# Altium project ESP32_HID_GLCD.PrjPcb
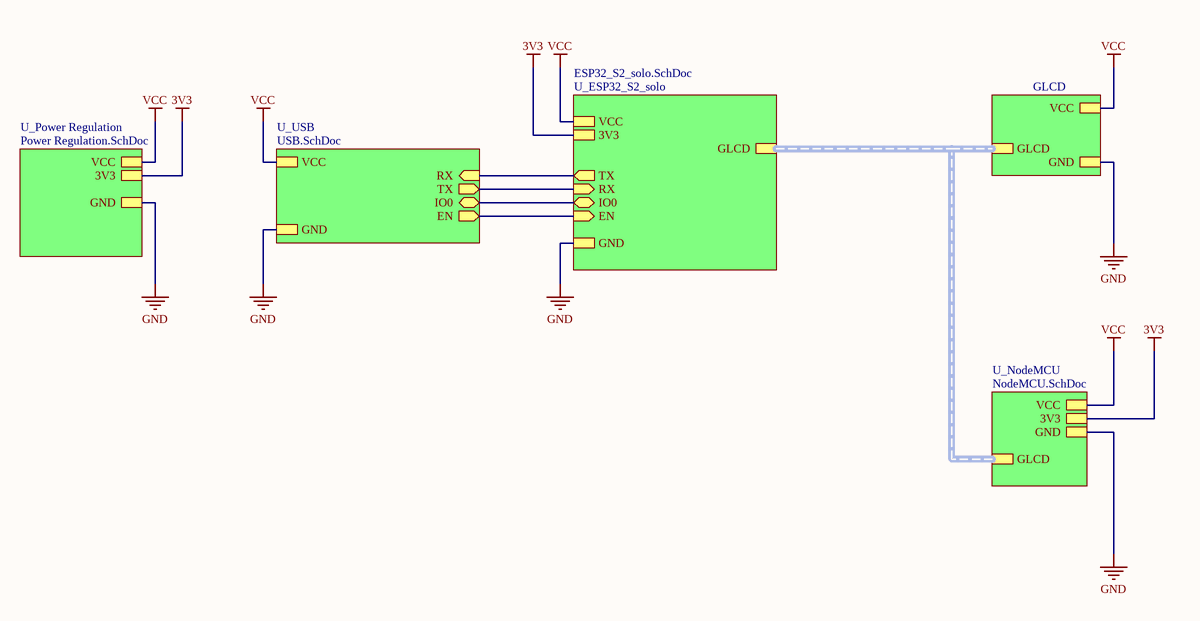
[diagram p0: Block Diagram.SchDoc]
6 sheets, 48 parts. Net scope: strictly hierarchical (ports join the sheet entries above them; power ports are local).
Board file: ESP32_HID.PcbDoc
Sheets:
  Block Diagram.SchDoc
    GLCD = GLCD.SchDoc
    U_ESP32_S2_solo = ESP32_S2_solo.SchDoc
    U_NodeMCU = NodeMCU.SchDoc
    U_Power Regulation = Power Regulation.SchDoc
    U_USB = USB.SchDoc

## Sheet Block Diagram.SchDoc: Block diagram
size A4; Engineer: Naif Aljophani; DocumentNumber: 1; Revision: V1.0; SheetNumber: 1; SheetTotal: 6

### Sub-sheets
GLCD = GLCD.SchDoc: VCC, GND, GLCD (harness GLCD)
U_ESP32_S2_solo = ESP32_S2_solo.SchDoc: 3V3, GND, VCC, IO0 (bidir), EN (in), TX (out), RX (in), GLCD (harness GLCD)
U_NodeMCU = NodeMCU.SchDoc: VCC, 3V3, GND, GLCD (harness GLCD)
U_Power Regulation = Power Regulation.SchDoc: 3V3, GND, VCC
U_USB = USB.SchDoc: GND, EN (out), IO0 (bidir), VCC, RX (in), TX (out)

### Nets
3V3: sheet U_ESP32_S2_solo/3V3, sheet U_NodeMCU/3V3, sheet U_Power Regulation/3V3
GND: sheet GLCD/GND, sheet U_ESP32_S2_solo/GND, sheet U_NodeMCU/GND, sheet U_Power Regulation/GND, sheet U_USB/GND
VCC: sheet GLCD/VCC, sheet U_ESP32_S2_solo/VCC, sheet U_NodeMCU/VCC, sheet U_Power Regulation/VCC, sheet U_USB/VCC
EN: sheet U_ESP32_S2_solo/EN, sheet U_USB/EN
IO0: sheet U_ESP32_S2_solo/IO0, sheet U_USB/IO0
UART1: sheet U_ESP32_S2_solo/RX, sheet U_USB/TX
UART2: sheet U_ESP32_S2_solo/TX, sheet U_USB/RX

### Buses and harness runs
harness sheet GLCD/GLCD = sheet U_ESP32_S2_solo/GLCD = sheet U_NodeMCU/GLCD

## Sheet GLCD.SchDoc: GLCD ILI9488
size A4; Engineer: Naif Aljohani; DocumentNumber: 2; Revision: V1.0; SheetNumber: 2; SheetTotal: 8
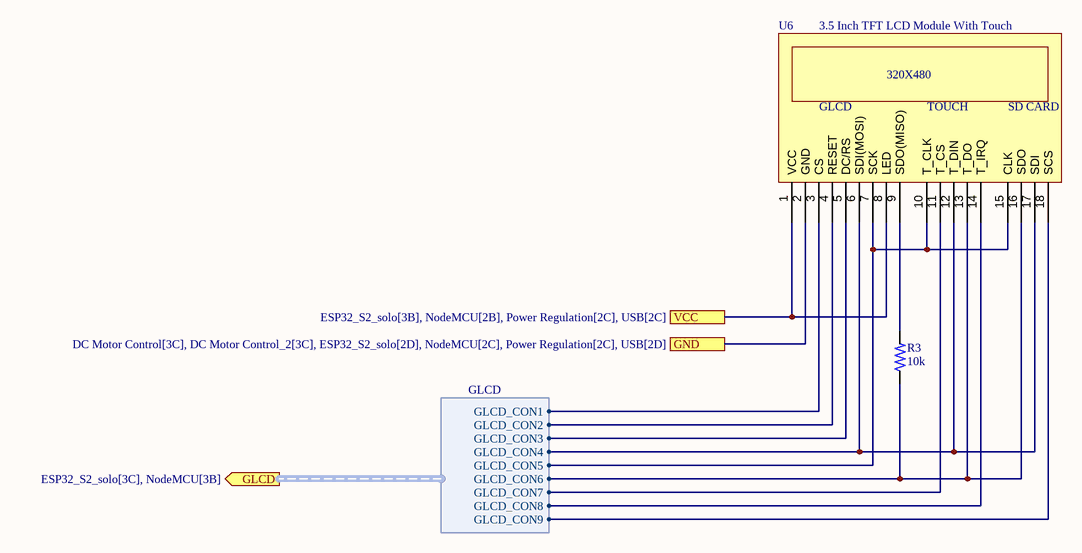
[diagram p1: GLCD.SchDoc]

### Parts
R3  10k  [RESC3115X65N]
U6  3.5 Inch TFT LCD Module With Touch  [PCBComponent_1]

### Ports
GLCD (out, harness GLCD, see ESP32_S2_solo[3C], NodeMCU[3B]), GND (see DC Motor Control[3C], DC Motor Control_2[3C], ESP32_S2_solo[2D], NodeMCU[2C], Power Regulation[2C], USB[2D]), VCC (see ESP32_S2_solo[3B], NodeMCU[2B], Power Regulation[2C], USB[2C])

### Harnesses
GLCD: GLCD_CON1, GLCD_CON2, GLCD_CON3, GLCD_CON4, GLCD_CON5, GLCD_CON6, GLCD_CON7, GLCD_CON8, GLCD_CON9

### Nets
GND: U6.2(GND) ; port GND
VCC: U6.1(VCC) U6.8(LED) ; port VCC
GLCD_CON1: U6.3(CS) ; port GLCD.GLCD_CON1
GLCD_CON2: U6.4(RESET) ; port GLCD.GLCD_CON2
GLCD_CON3: U6.5(DC/RS) ; port GLCD.GLCD_CON3
GLCD_CON4: U6.6(SDI(MOSI)) U6.12(T_DIN) U6.17(SDI) ; port GLCD.GLCD_CON4
GLCD_CON5: U6.7(SCK) U6.10(T_CLK) U6.15(CLK) ; port GLCD.GLCD_CON5
GLCD_CON6: R3.1 U6.13(T_DO) U6.16(SDO) ; port GLCD.GLCD_CON6
GLCD_CON7: U6.11(T_CS) ; port GLCD.GLCD_CON7
GLCD_CON8: U6.14(T_IRQ) ; port GLCD.GLCD_CON8
GLCD_CON9: U6.18(SCS) ; port GLCD.GLCD_CON9
NetR3_2: R3.2 U6.9(SDO(MISO))

### Notes on the sheet
- (in symbol ILI9488) 320X480; GLCD; TOUCH; SD CARD

### Library data of the parts
R3 = 1-1879462-4: RL73H 2B R43 1% 10 RL; MF: {'manufacturer': u'TE Connectivity'}; Package: None; Price: None; Value: *; MP: 1-1879462-4; Availability: Unavailable
U6 = ILI9488: ComponentLink1Description: New link; ComponentLink1URL: https://www.aliexpress.com/item/32954128438.html?spm=a2g0o.order_list.order_list_main.44.5fd61802HfjXd0

## Sheet ESP32_S2_solo.SchDoc
size A4; Engineer: Naif Aljohani; DocumentNumber: 3; Revision: v1.0; SheetNumber: 3; SheetTotal: 6; SPICEModelCacheSFRKXKUM: <root> / <DocumentId>SFRKXKUM</DocumentId> / </root>
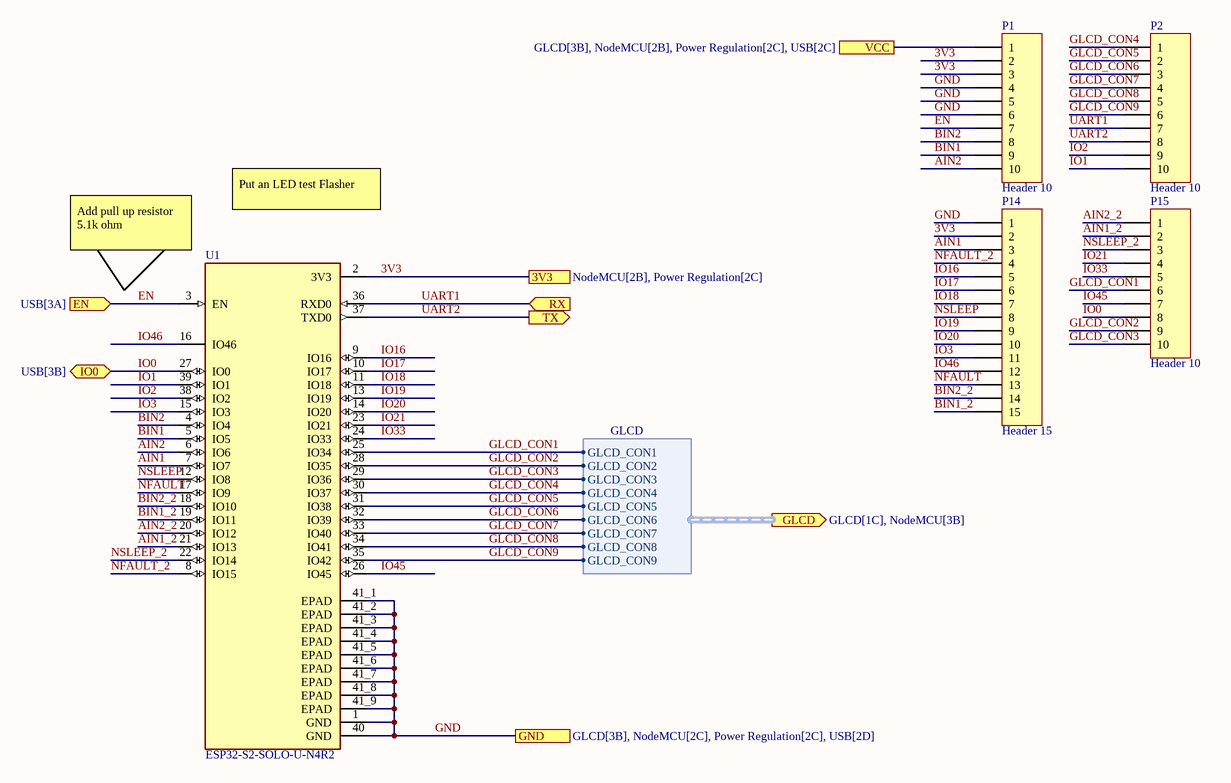
[diagram p2: ESP32_S2_solo.SchDoc]

### Parts
P1  Header 10  [HDR1X10]
P2  Header 10  [HDR1X10]
P14  Header 15  [HDR1X15]
P15  Header 10  [HDR1X10]
U1  ESP32-S2-SOLO-U-N4R2  [XCVR_ESP32-S2-SOLO-U-N4R2]

### Ports
3V3 (see NodeMCU[2B], Power Regulation[2C]), EN (in, see USB[3A]), GLCD (out, harness GLCD, see GLCD[1C], NodeMCU[3B]), GND (see GLCD[3B], NodeMCU[2C], Power Regulation[2C], USB[2D]), IO0 (bidir, see USB[3B]), RX (in), TX (out), VCC (see GLCD[3B], NodeMCU[2B], Power Regulation[2C], USB[2C])

### Harnesses
GLCD: GLCD_CON1, GLCD_CON2, GLCD_CON3, GLCD_CON4, GLCD_CON5, GLCD_CON6, GLCD_CON7, GLCD_CON8, GLCD_CON9

### Nets
3V3: P1.2 P1.3 P14.2 U1.2(3V3) ; port 3V3
GND: P1.4 P1.5 P1.6 P14.1 U1.1(GND) U1.40(GND) U1.41_1(EPAD) U1.41_2(EPAD) U1.41_3(EPAD) U1.41_4(EPAD) U1.41_5(EPAD) U1.41_6(EPAD) U1.41_7(EPAD) U1.41_8(EPAD) U1.41_9(EPAD) ; port GND
VCC: P1.1 ; port VCC
AIN1: P14.3 U1.7(IO7)
AIN1_2: P15.2 U1.21(IO13)
AIN2: P1.10 U1.6(IO6)
AIN2_2: P15.1 U1.20(IO12)
BIN1: P1.9 U1.5(IO5)
BIN1_2: P14.15 U1.19(IO11)
BIN2: P1.8 U1.4(IO4)
BIN2_2: P14.14 U1.18(IO10)
EN: P1.7 U1.3(EN) ; port EN
GLCD_CON1: P15.6 U1.25(IO34) ; port GLCD.GLCD_CON1
GLCD_CON2: P15.9 U1.28(IO35) ; port GLCD.GLCD_CON2
GLCD_CON3: P15.10 U1.29(IO36) ; port GLCD.GLCD_CON3
GLCD_CON4: P2.1 U1.30(IO37) ; port GLCD.GLCD_CON4
GLCD_CON5: P2.2 U1.31(IO38) ; port GLCD.GLCD_CON5
GLCD_CON6: P2.3 U1.32(IO39) ; port GLCD.GLCD_CON6
GLCD_CON7: P2.4 U1.33(IO40) ; port GLCD.GLCD_CON7
GLCD_CON8: P2.5 U1.34(IO41) ; port GLCD.GLCD_CON8
GLCD_CON9: P2.6 U1.35(IO42) ; port GLCD.GLCD_CON9
IO0: P15.8 U1.27(IO0) ; port IO0
IO1: P2.10 U1.39(IO1)
IO2: P2.9 U1.38(IO2)
IO3: P14.11 U1.15(IO3)
IO16: P14.5 U1.9(IO16)
IO17: P14.6 U1.10(IO17)
IO18: P14.7 U1.11(IO18)
IO19: P14.9 U1.13(IO19)
IO20: P14.10 U1.14(IO20)
IO21: P15.4 U1.23(IO21)
IO33: P15.5 U1.24(IO33)
IO45: P15.7 U1.26(IO45)
IO46: P14.12 U1.16(IO46)
NFAULT: P14.13 U1.17(IO9)
NFAULT_2: P14.4 U1.8(IO15)
NSLEEP: P14.8 U1.12(IO8)
NSLEEP_2: P15.3 U1.22(IO14)
UART1: P2.7 U1.36(RXD0) ; port RX
UART2: P2.8 U1.37(TXD0) ; port TX

### Notes on the sheet
- Put an LED test Flasher
- (near U1) Add pull up resistor 5.1k ohm

### Library data of the parts
P1 P2 P15 = Header 10: Header, 10-Pin; LatestRevisionDate: 17-Jul-2002; LatestRevisionNote: Re-released for DXP Platform.; Publisher: Altium Limited
P14 = Header 15: Header, 15-Pin; LatestRevisionDate: 17-Jul-2002; LatestRevisionNote: Re-released for DXP Platform.; Publisher: Altium Limited
U1 = ESP32-S2-SOLO-U-N4R2: MF: {'manufacturer': u'Espressif Systems'}; Package: None; Price: None; MP: ESP32-S2-SOLO-U-N4R2; Availability: Unavailable; Value: *

## Sheet NodeMCU.SchDoc
size A4; Engineer: Naif Aljohani; DocumentNumber: 5; Revision: v1.0; SheetNumber: 5; SheetTotal: 7
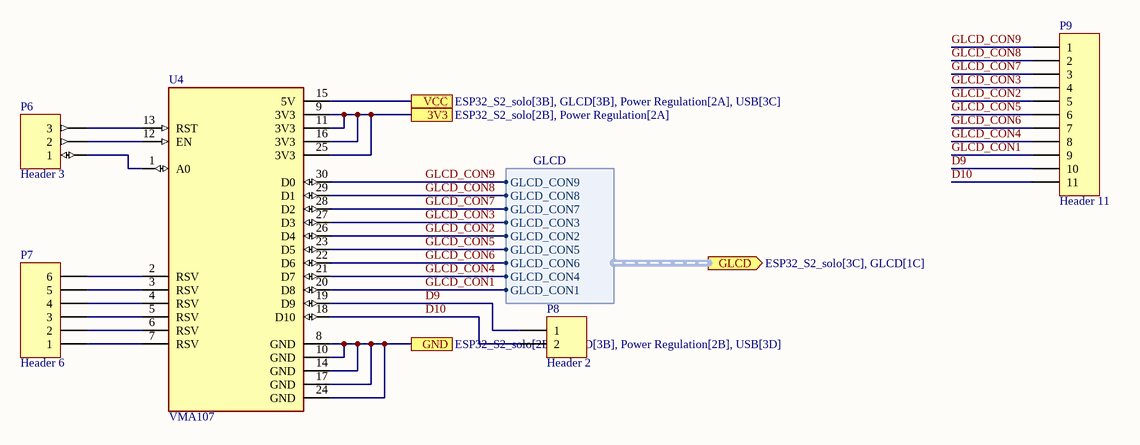
[diagram p3: NodeMCU.SchDoc]

### Parts
P6  Header 3  [HDR1X3]
P7  Header 6  [HDR1X6]
P8  Header 2  [HDR1X2]
P9  Header 11  [HDR1X11]
U4  VMA107  [MODULE_VMA107]

### Ports
3V3 (see ESP32_S2_solo[2B], Power Regulation[2A]), GLCD (out, harness GLCD, see ESP32_S2_solo[3C], GLCD[1C]), GND (see ESP32_S2_solo[2D], GLCD[3B], Power Regulation[2B], USB[3D]), VCC (see ESP32_S2_solo[3B], GLCD[3B], Power Regulation[2A], USB[3C])

### Harnesses
GLCD: GLCD_CON1, GLCD_CON2, GLCD_CON3, GLCD_CON4, GLCD_CON5, GLCD_CON6, GLCD_CON7, GLCD_CON8, GLCD_CON9

### Nets
3V3: U4.9(3V3) U4.11(3V3) U4.16(3V3) U4.25(3V3) ; port 3V3
GND: U4.8(GND) U4.10(GND) U4.14(GND) U4.17(GND) U4.24(GND) ; port GND
VCC: U4.15(5V) ; port VCC
D9: P8.1 P9.10 U4.19(D9)
D10: P8.2 P9.11 U4.18(D10)
GLCD_CON1: P9.9 U4.20(D8) ; port GLCD.GLCD_CON1
GLCD_CON2: P9.5 U4.26(D4) ; port GLCD.GLCD_CON2
GLCD_CON3: P9.4 U4.27(D3) ; port GLCD.GLCD_CON3
GLCD_CON4: P9.8 U4.21(D7) ; port GLCD.GLCD_CON4
GLCD_CON5: P9.6 U4.23(D5) ; port GLCD.GLCD_CON5
GLCD_CON6: P9.7 U4.22(D6) ; port GLCD.GLCD_CON6
GLCD_CON7: P9.3 U4.28(D2) ; port GLCD.GLCD_CON7
GLCD_CON8: P9.2 U4.29(D1) ; port GLCD.GLCD_CON8
GLCD_CON9: P9.1 U4.30(D0) ; port GLCD.GLCD_CON9
NetP6_1: P6.1 U4.1(A0)
NetP6_2: P6.2 U4.12(EN)
NetP6_3: P6.3 U4.13(RST)
NetP7_1: P7.1 U4.7(RSV)
NetP7_2: P7.2 U4.6(RSV)
NetP7_3: P7.3 U4.5(RSV)
NetP7_4: P7.4 U4.4(RSV)
NetP7_5: P7.5 U4.3(RSV)
NetP7_6: P7.6 U4.2(RSV)

### Library data of the parts
P6 = Header 3: Header, 3-Pin; LatestRevisionDate: 17-Jul-2002; LatestRevisionNote: Re-released for DXP Platform.; Publisher: Altium Limited
P7 = Header 6: Header, 6-Pin; LatestRevisionDate: 17-Jul-2002; LatestRevisionNote: Re-released for DXP Platform.; Publisher: Altium Limited
P8 = Header 2: Header, 2-Pin; LatestRevisionDate: 17-Jul-2002; LatestRevisionNote: Re-released for DXP Platform.; Publisher: Altium Limited
P9 = Header 11: Header, 11-Pin; LatestRevisionDate: 17-Jul-2002; LatestRevisionNote: Re-released for DXP Platform.; Publisher: Altium Limited
U4 = VMA107: NodeMCU V2 Lua Based ESP8266 Development Board; MF: {'manufacturer': u'Velleman'}; Package: None; Price: None; Value: *; MP: VMA107; Availability: Unavailable

## Sheet Power Regulation.SchDoc
size A4; Engineer: Naif Aljohani; DocumentNumber: 7; Revision: v1.0; SheetNumber: 6; SheetTotal: 6
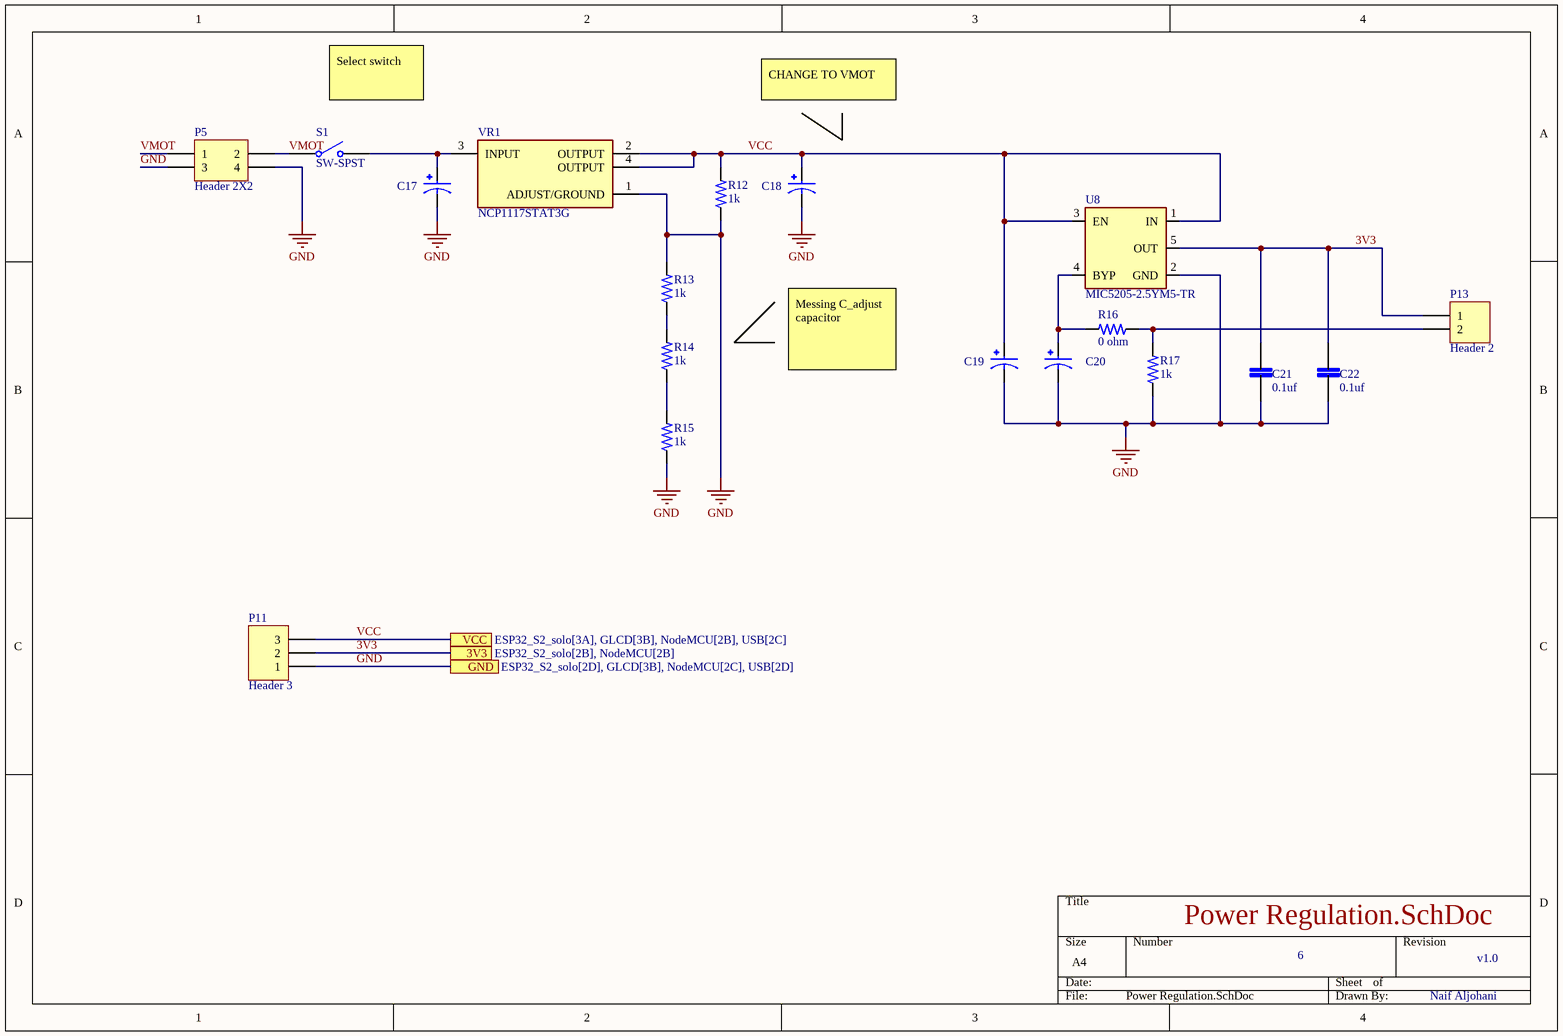
[diagram p4: Power Regulation.SchDoc]

### Parts
C17  EEEHA1V101UP  [CAP_EEEHA1V101UP]  (value not drawn)
C18  EEEHA1V101UP  [CAP_EEEHA1V101UP]  (value not drawn)
C19  EEEHA1V101UP  [CAP_EEEHA1V101UP]  (value not drawn)
C20  EEEHA1V101UP  [CAP_EEEHA1V101UP]  (value not drawn)
C21  0.1uf  [CAPC2012X140N]
C22  0.1uf  [CAPC2012X140N]
P5  Header 2X2  [HDR2X2]
P11  Header 3  [HDR1X3]
P13  Header 2  [HDR1X2]
R12  1k  [RESC3115X65N]
R13  1k  [RESC3115X65N]
R14  1k  [RESC3115X65N]
R15  1k  [RESC3115X65N]
R16  0 ohm  [RESC3115X65N]
R17  1k  [RESC3115X65N]
S1  SW-SPST  [SPST-2]
U8  MIC5205-2.5YM5-TR  [SOT95P280X145-5N]
VR1  NCP1117STAT3G  [VREG_NCP1117STAT3G]

### Ports
3V3 (see ESP32_S2_solo[2B], NodeMCU[2B]), GND (see ESP32_S2_solo[2D], GLCD[3B], NodeMCU[2C], USB[2D]), VCC (see ESP32_S2_solo[3A], GLCD[3B], NodeMCU[2B], USB[2C])

### Nets
3V3: C21.2 C22.2 P11.2 P13.1 U8.5(OUT) ; port 3V3
GND: C17.2 C18.2 C19.2 C20.2 C21.1 C22.1 P5.3 P5.4 P11.1 R12.1 R13.2 R15.1 R17.1 U8.2(GND) VR1.1(ADJUST/GROUND) ; port GND
VCC: C18.1 C19.1 P11.3 R12.2 U8.1(IN) U8.3(EN) VR1.2(OUTPUT) VR1.4(OUTPUT) ; port VCC
VMOT: P5.1 P5.2 S1.1(COMMON)
NetC17_1: C17.1 S1.2(NO) VR1.3(INPUT)
NetC20_1: C20.1 R16.2 U8.4(BYP)
NetP13_2: P13.2 R16.1 R17.2
NetR13_1: R13.1 R14.2
NetR14_1: R14.1 R15.2

### Notes on the sheet
- Select switch
- CHANGE TO VMOT
- Messing C_adjust   capacitor

### Library data of the parts
C17-C20 = EEEHA1V101UP: MF: {'manufacturer': u'Panasonic'}; Value: *; MP: EEEHA1V101UP; Availability: Unavailable; Package: None; Price: None
C21 C22 = LD051A121KAB2A: 120PF 100V 10% 0805; MF: {'manufacturer': u'AVX'}; Package: None; Price: None; Value: *; MP: LD051A121KAB2A; Availability: Unavailable
P5 = Header 2X2: Header, 2-Pin, Dual row; LatestRevisionDate: 17-Jul-2002; LatestRevisionNote: Re-released for DXP Platform.; Publisher: Altium Limited
P11 = Header 3: Header, 3-Pin; LatestRevisionDate: 17-Jul-2002; LatestRevisionNote: Re-released for DXP Platform.; Publisher: Altium Limited
P13 = Header 2: Header, 2-Pin; LatestRevisionDate: 17-Jul-2002; LatestRevisionNote: Re-released for DXP Platform.; Publisher: Altium Limited
R12-R17 = 1-1879462-4: as R3 on sheet GLCD; Package: None; Price: None; Value: *; MP: 1-1879462-4; Availability: Unavailable
S1 = SW-SPST: Single-Pole, Single-Throw Switch; Published: 24-Mar-1999; LatestRevisionDate: 17-Jul-2002; LatestRevisionNote: Re-released for DXP Platform.; PackageReference: SPST-2; Publisher: Altium Limited; PackageDescription: Switch; 2 Leads
U8 = MIC5205-2.5YM5-TR: MIC5205 Series 3 V Fixed Output 150 mA SMT Low-Noise LDO Regulator - SOT-23-5; MF: {'manufacturer': u'Microchip Technology'}; Price: None; MP: MIC5205-2.5YM5-TR; Availability: Unavailable; Value: *; Package: None
VR1 = NCP1117STAT3G: Linear Voltage Regulator IC 1 Output 1A SOT-223; MF: {'manufacturer': u'ON Semiconductor'}; Value: *; MP: NCP1117STAT3G; Availability: Unavailable; Package: None; Price: None

## Sheet USB.SchDoc
size A4; Engineer: Naif aljohani; DocumentNumber: 4; Revision: v1.0; SheetNumber: 4; SheetTotal: 6; SPICEModelCacheVKQZRFRK: <root> / <DocumentId>VKQZRFRK</DocumentId> / <CacheFrame Number="0"> / <Model Name="1n4148" Kind="MDL"> / <Text>.model 1N4148  D(Is=0.1p Rs=16 CJO=2p Tt=12n Bv=100 Ibv=0.1p)</Text> / </Model> / </CacheFrame> / </root>
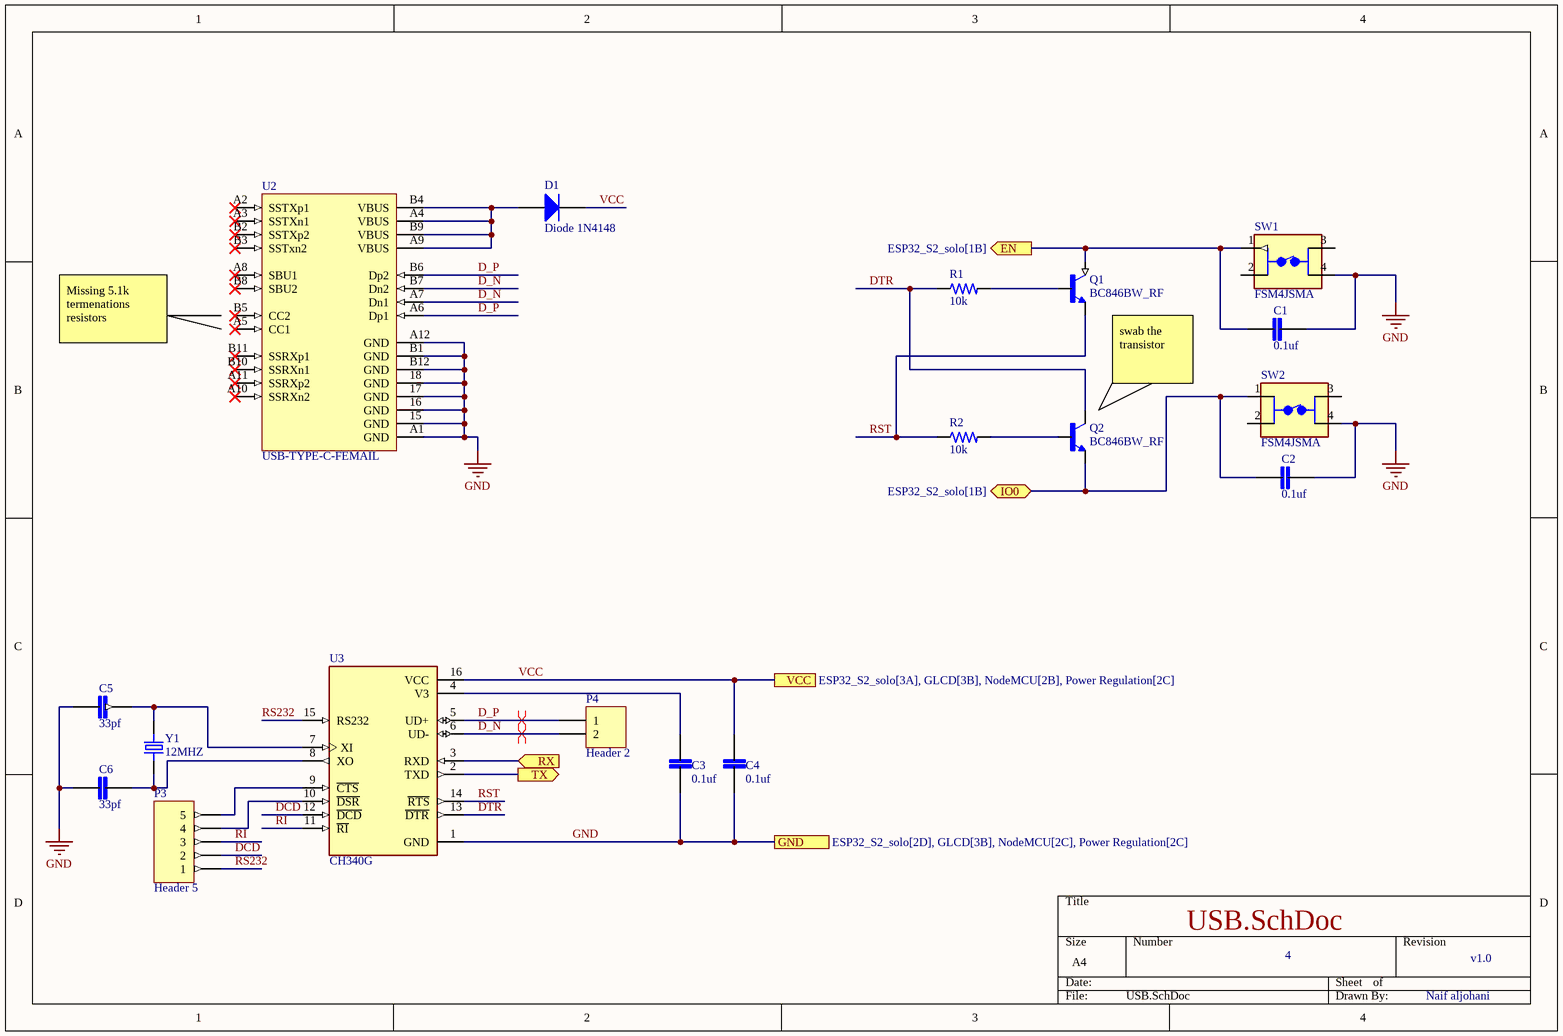
[diagram p5: USB.SchDoc]

### Parts
C1  0.1uf  [CAPC2012X140N]
C2  0.1uf  [CAPC2012X140N]
C3  0.1uf  [CAPC2012X140N]
C4  0.1uf  [CAPC2012X140N]
C5  33pf  [CAPC2012X140N]
C6  33pf  [CAPC2012X140N]
D1  Diode 1N4148  [DO-35]
P3  Header 5  [HDR1X5]
P4  Header 2  [HDR1X2]
Q1  BC846BW_RF  [TRANS_BC846BW_RF]
Q2  BC846BW_RF  [TRANS_BC846BW_RF]
R1  10k  [RESC3115X65N]
R2  10k  [RESC3115X65N]
SW1  FSM4JSMA  [TE_FSM4JSMA]
SW2  FSM4JSMA  [TE_FSM4JSMA]
U2  USB-TYPE-C-FEMAIL  [C5156605]
U3  CH340G  [SOIC127P600X180-16N]
Y1  12MHZ  [XTAL_ECS-51-S-1]

### Ports
EN (out, see ESP32_S2_solo[1B]), GND (see ESP32_S2_solo[2D], GLCD[3B], NodeMCU[2C], Power Regulation[2C]), IO0 (bidir, see ESP32_S2_solo[1B]), RX (in), TX (out), VCC (see ESP32_S2_solo[3A], GLCD[3B], NodeMCU[2B], Power Regulation[2C])

### Nets
GND: C1.2 C2.2 C3.1 C4.1 C5.2 C6.2 SW1.4 SW2.4 U2.15(GND) U2.16(GND) U2.17(GND) U2.18(GND) U2.A1(GND) U2.A12(GND) U2.B1(GND) U2.B12(GND) U3.1(GND) ; port GND
VCC: C4.2 D1.2(K) U3.16(VCC) ; port VCC
D_N: P4.2 U2.A7(Dn1) U2.B7(Dn2) U3.6(UD-)
D_P: P4.1 U2.A6(Dp1) U2.B6(Dp2) U3.5(UD+)
DCD: P3.2 U3.12(~{DCD})
DTR: Q2.3(C) R1.1 U3.13(~{DTR})
EN: C1.1 Q1.3(C) SW1.1 ; port EN
IO0: C2.1 Q2.2(E) SW2.1 ; port IO0
RI: P3.3 U3.11(~{RI})
RS232: P3.1 U3.15(RS232)
RST: Q1.2(E) R2.1 U3.14(~{RTS})
UART1: U3.2(TXD) ; port TX
UART2: U3.3(RXD) ; port RX
NetC3_2: C3.2 U3.4(V3)
NetC5_1: C5.1 U3.7(XI) Y1.2
NetC6_1: C6.1 U3.8(XO) Y1.1
NetD1_1: D1.1(A) U2.A4(VBUS) U2.A9(VBUS) U2.B4(VBUS) U2.B9(VBUS)
NetP3_4: P3.4 U3.10(~{DSR})
NetP3_5: P3.5 U3.9(~{CTS})
NetQ1_1: Q1.1(B) R1.2
NetQ2_1: Q2.1(B) R2.2

Not connected (* = marked no-connect by the designer): SW1 2 3; SW2 2 3; U2 A2(SSTXp1)* A3(SSTXn1)* A5(CC1)* A8(SBU1)* A10(SSRXn2)* A11(SSRXp2)* B2(SSTXp2)* B3(SSTxn2)* B5(CC2)* B8(SBU2)* B10(SSRXn1)* B11(SSRXp1)*

### Layout directives
differential pair: D_N, D_P

### Notes on the sheet
- Missing 5.1k termenations resistors
- swab the transistor

### Library data of the parts
C1-C6 = LD051A121KAB2A: as C21 on sheet Power Regulation; Package: None; Price: None; Value: *; MP: LD051A121KAB2A; Availability: Unavailable
D1 = Diode 1N4148: High Conductance Fast Diode; Published: 8-Jun-2000; LatestRevisionDate: 17-Jul-2002; LatestRevisionNote: Re-released for DXP Platform.; DatasheetVersion: 1997; PackageReference: DO-35; Publisher: Altium Limited; PackageDescription: Diode, Axial; Body 3.8 x 1.9 mm (LxDia. max), Lead Dia. 0.53 mm (max); Code_JEDEC: DO-204-AH; ComponentLink1Description: Manufacturer Link; ComponentLink1URL: http://www.fairchildsemi.com/; ComponentLink2Description: Datasheet; ComponentLink2URL: http://www.fairchildsemi.com/ds/1N%2F1N4148.pdf
P3 = Header 5: Header, 5-Pin; LatestRevisionDate: 17-Jul-2002; LatestRevisionNote: Re-released for DXP Platform.; Publisher: Altium Limited
P4 = Header 2: Header, 2-Pin; LatestRevisionDate: 17-Jul-2002; LatestRevisionNote: Re-released for DXP Platform.; Publisher: Altium Limited
Q1 Q2 = BC846BW_RF: MF: {'manufacturer': u'Taiwan Semiconductor'}; Package: None; Price: None; Value: *; MP: BC846BW_RF; Availability: Unavailable
R1 R2 = 1-1879462-4: as R3 on sheet GLCD; Package: None; Price: None; Value: *; MP: 1-1879462-4; Availability: Unavailable
SW1 SW2 = FSM4JSMA: Switch Tactile OFF (ON) SPST Round Button Gull Wing 0.05A 24VDC 2.6N SMD T/R; MF: {'manufacturer': u'TE Connectivity'}; Value: *; Price: None; Availability: Unavailable; Package: None; MP: FSM4JSMA
U3 = CH340G: MF: {'manufacturer': u'WCH'}; MP: CH340G; Package: None; Price: None; Value: *; Availability: Unavailable
Y1 = ECS-51-S-1: MF: {'manufacturer': u'ECS'}; Package: None; Price: None; Value: *; MP: ECS-51-S-1; Availability: Unavailable

## Nets that join several sheets
3V3: ESP32_S2_solo (P1.2 P1.3 P14.2 U1.2), NodeMCU (U4.9 U4.11 U4.16 U4.25), Power Regulation (5 pins)
GND: GLCD (U6.2), ESP32_S2_solo (15 pins), NodeMCU (5 pins), Power Regulation (15 pins), USB (17 pins)
VCC: GLCD (U6.1 U6.8), ESP32_S2_solo (P1.1), NodeMCU (U4.15), Power Regulation (8 pins), USB (C4.2 D1.2 U3.16)
EN: ESP32_S2_solo (P1.7 U1.3), USB (C1.1 Q1.3 SW1.1)
GLCD_CON1: GLCD (U6.3), ESP32_S2_solo (P15.6 U1.25), NodeMCU (P9.9 U4.20)
GLCD_CON2: GLCD (U6.4), ESP32_S2_solo (P15.9 U1.28), NodeMCU (P9.5 U4.26)
GLCD_CON3: GLCD (U6.5), ESP32_S2_solo (P15.10 U1.29), NodeMCU (P9.4 U4.27)
GLCD_CON4: GLCD (U6.6 U6.12 U6.17), ESP32_S2_solo (P2.1 U1.30), NodeMCU (P9.8 U4.21)
GLCD_CON5: GLCD (U6.7 U6.10 U6.15), ESP32_S2_solo (P2.2 U1.31), NodeMCU (P9.6 U4.23)
GLCD_CON6: GLCD (R3.1 U6.13 U6.16), ESP32_S2_solo (P2.3 U1.32), NodeMCU (P9.7 U4.22)
GLCD_CON7: GLCD (U6.11), ESP32_S2_solo (P2.4 U1.33), NodeMCU (P9.3 U4.28)
GLCD_CON8: GLCD (U6.14), ESP32_S2_solo (P2.5 U1.34), NodeMCU (P9.2 U4.29)
GLCD_CON9: GLCD (U6.18), ESP32_S2_solo (P2.6 U1.35), NodeMCU (P9.1 U4.30)
IO0: ESP32_S2_solo (P15.8 U1.27), USB (C2.1 Q2.2 SW2.1)
UART1: ESP32_S2_solo (P2.7 U1.36), USB (U3.2)
UART2: ESP32_S2_solo (P2.8 U1.37), USB (U3.3)